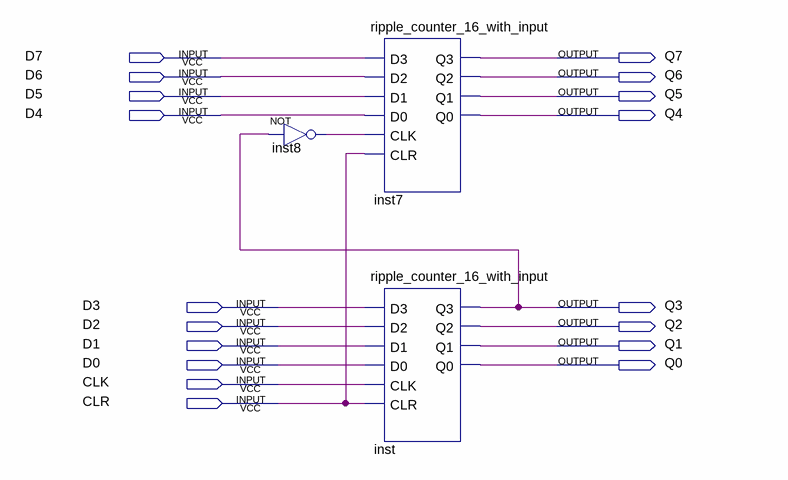
[diagram p0: schematic sheet]
// Quartus schematic ripple_counter_256_with_input.bdf as structural Verilog: 3 symbols, 18 pins
module ripple_counter_256_with_input (
  input  D7,
  input  D6,
  input  D5,
  input  D4,
  input  D3,
  input  D2,
  input  D1,
  input  D0,
  input  CLK,
  input  CLR,
  output Q7,
  output Q6,
  output Q5,
  output Q4,
  output Q3,
  output Q2,
  output Q1,
  output Q0
);

  wire inst8_out;

  not inst8 (inst8_out, Q3);
  ripple_counter_16_with_input inst7 (
    .D3(D7), .D2(D6), .D1(D5), .D0(D4), .CLK(inst8_out), .CLR(CLR), .Q3(Q7), .Q2(Q6), .Q1(Q5), .Q0(Q4));
  ripple_counter_16_with_input inst (
    .D3(D3), .D2(D2), .D1(D1), .D0(D0), .CLK(CLK), .CLR(CLR), .Q3(Q3), .Q2(Q2), .Q1(Q1), .Q0(Q0));
endmodule
